# Altium schematic sheet main.SchDoc
size A4
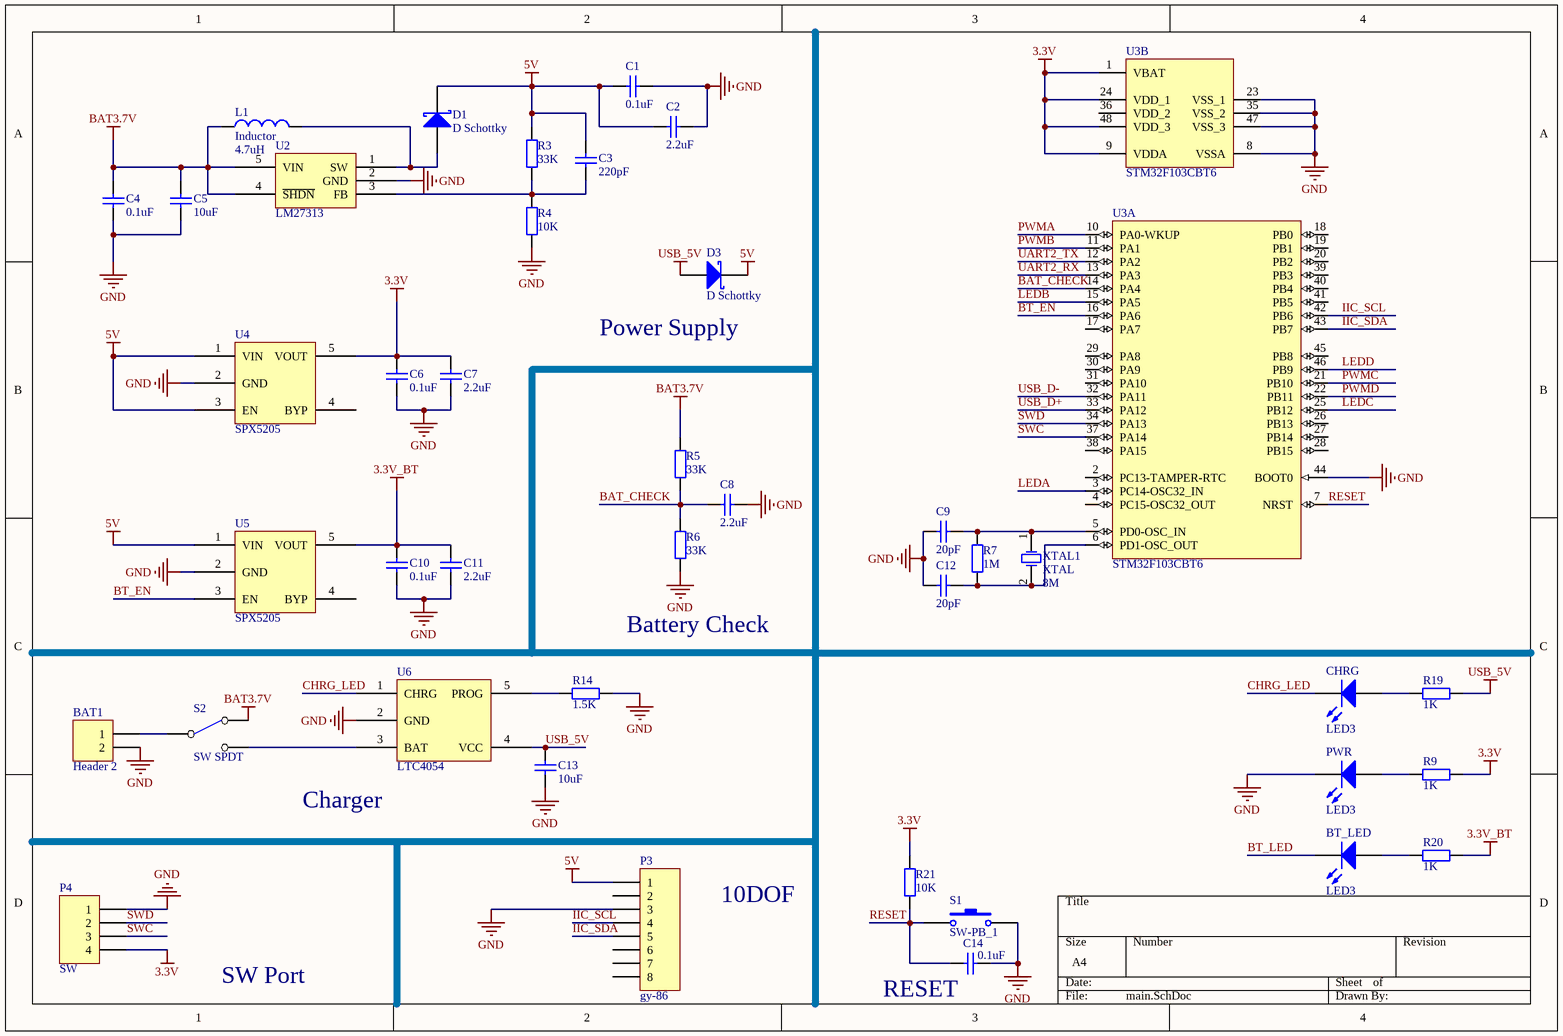
[diagram p0: main.SchDoc]

## Parts
BAT1  Header 2  [HDR1*2 battery]
BT_LED  LED3  [LED_0603_RED]
C1  value 0.1uF  [C-0603]  (hidden comment: Cap Semi)
C2  value 2.2uF  [C-0603]  (hidden comment: Cap Semi)
C3  value 220pF  [C-0603]  (hidden comment: Cap Semi)
C4  value 0.1uF  [C-0603]  (hidden comment: Cap Semi)
C5  value 10uF  [C-0603]  (hidden comment: Cap Semi)
C6  value 0.1uF  [C-0603]  (hidden comment: Cap Semi)
C7  value 2.2uF  [C-0603]  (hidden comment: Cap Semi)
C8  value 2.2uF  [C-0603]  (hidden comment: Cap Semi)
C9  value 20pF  [C-0603]  (hidden comment: Cap)
C10  value 0.1uF  [C-0603]  (hidden comment: Cap Semi)
C11  value 2.2uF  [C-0603]  (hidden comment: Cap Semi)
C12  value 20pF  [C-0603]  (hidden comment: Cap)
C13  value 10uF  [C-0603]  (hidden comment: Cap Semi)
C14  value 0.1uF  [C-0603]  (hidden comment: Cap)
CHRG  LED3  [LED_0603_RED]
D1  D Schottky  [DIODE-1206]
D3  D Schottky  [DIODE-1206]
L1  Inductor  value 4.7uH  [L-SMD-7]
P3  gy-86  [HDR1X8]
P4  SW  [HDR1X4]
PWR  LED3  [LED_0603_RED]
R3  value 33K  [R-0603]  (hidden comment: Res2)
R4  value 10K  [R-0603]  (hidden comment: Res2)
R5  value 33K  [R-0603]  (hidden comment: Res2)
R6  value 33K  [R-0603]  (hidden comment: Res2)
R7  value 1M  [R-0603]  (hidden comment: Res2)
R9  value 1K  [R-0603]  (hidden comment: Res2)
R14  value 1.5K  [R-0603]  (hidden comment: Res2)
R19  value 1K  [R-0603]  (hidden comment: Res2)
R20  value 1K  [R-0603]  (hidden comment: Res2)
R21  value 10K  [R-0603]  (hidden comment: Res2)
S1  SW-PB_1  [SW-2-6*3]
S2  SW SPDT  [SW-SPDT 2mm]
U2  LM27313  [SOT23-5]
U3  STM32F103CBT6  [STM-LQFP48_M]  (parts A,B of 2)
U4  SPX5205  [SOT23-5]
U5  SPX5205  [SOT23-5]
U6  LTC4054  [SOT23-5]
XTAL1  XTAL  Frequence: 8M  [XTAL-QC49/SMD]

## Nets
3.3V: C6.1 C7.1 P4.4 R9.2 R21.2 U3.1(VBAT) U3.9(VDDA) U3.24(VDD_1) U3.48(VDD_3) U4.5(VOUT)
3.3V_BT: C10.1 C11.1 R20.2 U5.5(VOUT)
5V: C1.1 C2.1 C3.2 D1.2(K) D3.2(K) P3.1 R3.2 U4.1(VIN) U4.3(EN) U5.1(VIN)
BAT3.7V: C4.2 C5.2 L1.1 R5.2 S2.1(NC) U2.4(~{SHDN}) U2.5(VIN)
GND: BAT1.2 C1.2 C2.2 C4.1 C5.1 C6.2 C7.2 C8.1 C9.2 C10.2 C11.2 C12.2 C13.2 C14.1 P3.3 P4.1 PWR.2(K) R4.1 R6.1 R14.1 S1.2 U2.2(GND) U3.8(VSSA) U3.23(VSS_1) U3.35(VSS_2) U3.44(BOOT0) U3.47(VSS_3) U4.2(GND) U5.2(GND) U6.2(GND)
USB_5V: C13.1 D3.1(A) R19.2 U6.4(VCC)
BAT_CHECK: C8.2 R5.1 R6.2 U3.14(PA4)
BT_EN: U3.16(PA6) U5.3(EN)
BT_LED: BT_LED.2(K)
CHRG_LED: CHRG.2(K) U6.1(CHRG)
IIC_SCL: P3.4 U3.42(PB6)
IIC_SDA: P3.5 U3.43(PB7)
LEDA: U3.3(PC14-OSC32_IN)
LEDB: U3.15(PA5)
LEDC: U3.25(PB12)
LEDD: U3.46(PB9)
PWMA: U3.10(PA0-WKUP)
PWMB: U3.11(PA1)
PWMC: U3.21(PB10)
PWMD: U3.22(PB11)
RESET: C14.2 R21.1 S1.1 U3.7(NRST)
SWC: P4.3 U3.37(PA14)
SWD: P4.2 U3.34(PA13)
UART2_RX: U3.13(PA3)
UART2_TX: U3.12(PA2)
USB_D+: U3.33(PA12)
USB_D-: U3.32(PA11)
NetBAT1_1: BAT1.1 S2.2(COMMON)
NetBT_LED_1: BT_LED.1(A) R20.1
NetC3_1: C3.1 R3.1 R4.2 U2.3(FB)
NetC9_1: C9.1 R7.1 U3.5(PD0-OSC_IN) XTAL1.1
NetC12_1: C12.1 R7.2 U3.6(PD1-OSC_OUT) XTAL1.2
NetCHRG_1: CHRG.1(A) R19.1
NetD1_1: D1.1(A) L1.2 U2.1(SW)
NetPWR_1: PWR.1(A) R9.1
NetR14_2: R14.2 U6.5(PROG)
NetS2_3: S2.3(NO) U6.3(BAT)

Not connected (* = marked no-connect by the designer): P3 2 6 7 8; U3 2(PC13-TAMPER-RTC) 4(PC15-OSC32_OUT) 17(PA7) 18(PB0) 19(PB1) 20(PB2) 26(PB13) 27(PB14) 28(PB15) 29(PA8) 30(PA9) 31(PA10) 36(VDD_2) 38(PA15) 39(PB3) 40(PB4) 41(PB5) 45(PB8); U4 4(BYP); U5 4(BYP)

## Notes on the sheet
- (near D3) Power Supply
- Battery Check
- (near U6) Charger
- 10DOF
- SW Port
- (near C14) RESET

## Library data of the parts
BAT1 = Header 2: Header, 2-Pin; LatestRevisionDate: 17-Jul-2002; LatestRevisionNote: Re-released for DXP Platform.; Publisher: Altium Limited
BT_LED CHRG PWR = LED3: Typical BLUE SiC LED; Published: 8-Jun-2000; LatestRevisionDate: 17-Dec-2003; LatestRevisionNote: PCB Footprint replaced.; DatasheetVersion: 16-Apr-2002; PackageVersion: 16-Apr-2002; PackageReference: 3.5X2.8X1.9; Publisher: Altium Limited; PackageDescription: SM LED; 2 C-Bend Leads; Body 3.5 x 2.8 x 1.9 mm, inc leads (LxWxH typ)
C1-C14 = Cap Semi: Capacitor (Semiconductor SIM Model); Published: 8-Jun-2000; LatestRevisionDate: 29-May-2009; LatestRevisionNote: IPC-7351 Footprint Added.; PackageReference: C1206; Publisher: Altium Limited; PackageDescription: Chip Capacitor
D1 D3 = D Schottky: Schottky Diode; Published: 8-Jun-2000; LatestRevisionDate: 17-Jul-2002; LatestRevisionNote: Re-released for DXP Platform.; PackageReference: SMB; Publisher: Altium Limited; PackageDescription: DO-214-AA/SMB; 2 C-Bend Leads; Body 5.3 x 3.6 mm, inc. leads (LxW); Code_JEDEC: DO-214-AA
L1 = Inductor: Code_IEC: 1005; Published: 8-Jun-2000; LatestRevisionDate: 29-May-2009; LatestRevisionNote: IPC-7351 Footprint Added.; PackageReference: 0402-A; Publisher: Altium Limited; PackageDescription: Chip Inductor; Code_JEITA: 0402
P3 = Header 8: Header, 8-Pin; LatestRevisionDate: 17-Jul-2002; LatestRevisionNote: Re-released for DXP Platform.; Publisher: Altium Limited
P4 = Header 4: Header, 4-Pin; LatestRevisionDate: 17-Jul-2002; LatestRevisionNote: Re-released for DXP Platform.; Publisher: Altium Limited
R3-R7 R9 R14 R19-R21 = Res2: Resistor; Published: 8-Jun-2000; LatestRevisionDate: 17-Jul-2002; LatestRevisionNote: Re-released for DXP Platform.; PackageReference: AXIAL-0.4; Publisher: Altium Limited; PackageDescription: Axial Device, Thru-Hole; 2 Leads; 0.4 in Pin Spacing
S1 = SW-PB_1: Switch; Published: 24-Mar-1999; LatestRevisionDate: 17-Jul-2002; LatestRevisionNote: Re-released for DXP Platform.; PackageReference: SPST-2; Publisher: Altium Limited
U3 = STM32F103CBT6: ARM Cortex-M3 32-bit MCU, 128 KB Flash, 20 KB Internal RAM, 37 I/Os, 48-pin LQFP, -40 to 85 degC, Tray; A/D Converter: 2x12-bit (10 Channel); FLASH Size (Prog) (kB): 128; I/Os (High Current): 37; Internal RAM Size (kB): 20; Operating Frequency(F) (Processor speed) (MHz): 72; Supply Voltage(Vcc) min (V): 2; DatasheetVersion: Rev. 16; PackageVersion: Rev. 6, 06/2013; PackageReference: LQFP48; PackageDescription: 48-Pin Low Profile Quad Flat Package, 7 x 7 mm Body, 0.5 mm Pitch; Supplier 1: Digi-Key; Supplier Part Number 1: 497-6288-ND; Supplier 2: Farnell; Supplier Part Number 2: 1606327; Supplier 3: Newark; Supplier Part Number 3: 11N8296; Supplier 4: Newark; Supplier Part Number 4: 57P1214; Supplier 5: Mouser; Supplier Part Number 5: 511-STM32F103CBT6; Core: ARM Cortex-M3; Packing: Tray; Mounting Technology: Surface Mount; PartNumber: STM32F103CBT6; ComponentLink1Description: Manufacturer URL; ComponentLink1URL: http://www.st.com/web/en/home.html; ComponentLink2Description: Datasheet; ComponentLink2URL: http://www.st.com/st-web-ui/static/active/en/resource/technical/document/datasheet/CD00161566.pdf; ComponentLink3Description: Package Specification; ComponentLink3URL: http://www.st.com/st-web-ui/static/active/en/resource/technical/document/datasheet/DM00058181.pdf